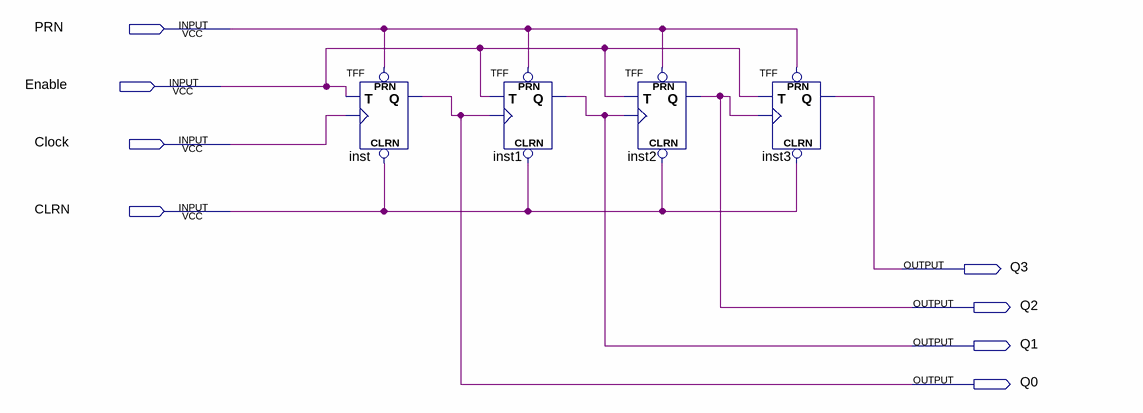
[diagram p0: schematic sheet]
// Quartus schematic lab10step3b.bdf as structural Verilog: 4 symbols, 8 pins
module lab10step3b (
  input  PRN,
  input  Enable,
  input  Clock,
  input  CLRN,
  output Q3,
  output Q2,
  output Q1,
  output Q0
);

  TFF inst (.PRN(PRN), .CLRN(CLRN), .T(Enable), .CLK(Clock), .Q(Q0));
  TFF inst1 (.PRN(PRN), .CLRN(CLRN), .T(Enable), .CLK(Q0), .Q(Q1));
  TFF inst2 (.PRN(PRN), .CLRN(CLRN), .T(Enable), .CLK(Q1), .Q(Q2));
  TFF inst3 (.PRN(PRN), .CLRN(CLRN), .T(Enable), .CLK(Q2), .Q(Q3));
endmodule
